# Altium schematic sheet LSE_Piezo_Driver.SchDoc
size A4
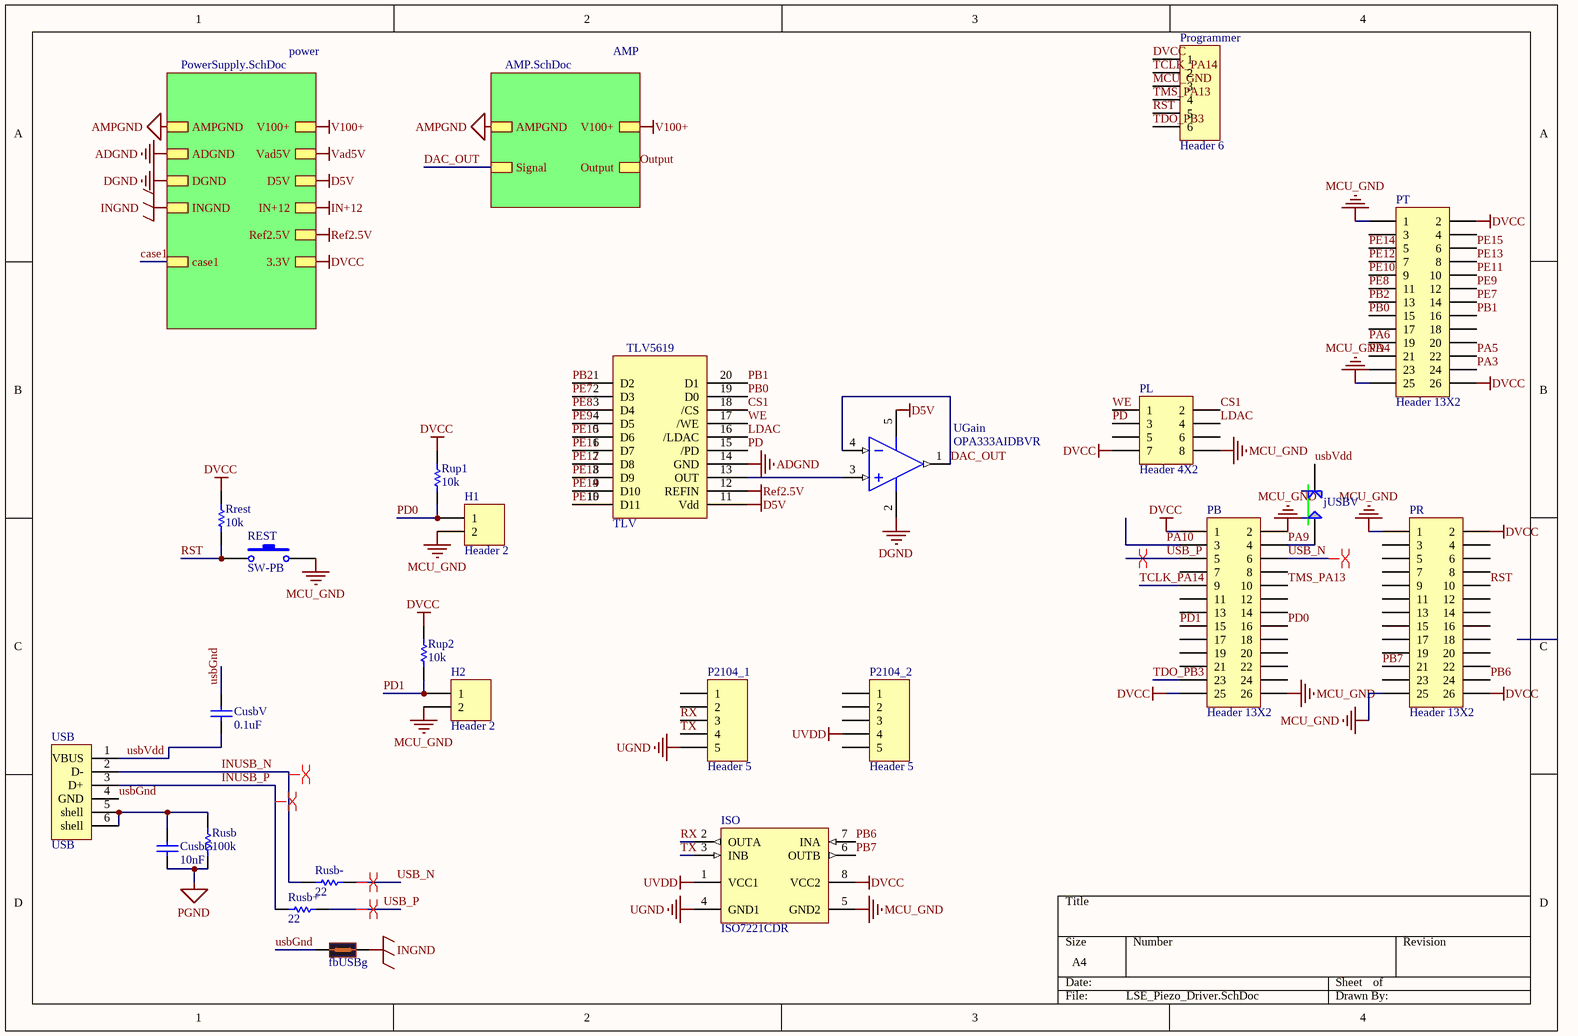
[diagram p0: LSE_Piezo_Driver.SchDoc]

## Parts
CusbG  value 10nF  [C_0603]  (hidden comment: ?)
CusbV  value 0.1uF  [C_0603]  (hidden comment: ?)
fbUSBg  MH2029-300YCT-ND  [FB_0805]  (value not drawn)
H1  Header 2  [HDR1X2]
H2  Header 2  [HDR1X2]
ISO  ISO7221CDR  [D0008A_N]
jUSBV  Jumper  [HDR1X2]  (value not drawn)
P2104_1  Header 5  [HDR1X5]
P2104_2  Header 5  [HDR1X5]
PB  Header 13X2  [HDR2X13]
PL  Header 4X2  [HDR2X4]
PR  Header 13X2  [HDR2X13]
Programmer  Header 6  [HDR1X6]
PT  Header 13X2  [HDR2X13]
REST  SW-PB  [SPST-2]
Rrest  value 10k  [0603]  (hidden comment: ?)
Rup1  value 10k  [0603]  (hidden comment: ?)
Rup2  value 10k  [0603]  (hidden comment: ?)
Rusb  value 100k  [0603]  (hidden comment: ?)
Rusb+  value 22  [0603]  (hidden comment: ?)
Rusb-  value 22  [0603]  (hidden comment: ?)
TLV  TLV5619  [DW020_L]  (value not drawn)
UGain  OPA333AIDBVR  [TI-DBV5_N]
USB  USB  [USB-B]

## Sub-sheets
AMP = AMP.SchDoc: AMPGND, V100+, Output, Signal
power = PowerSupply.SchDoc: ADGND, AMPGND, DGND, INGND, D5V, IN+12, Ref2.5V, V100+, Vad5V, 3.3V, case1

## Nets
ADGND: TLV.14(GND) ; sheet power/ADGND
AMPGND: sheet power/AMPGND, sheet AMP/AMPGND
D5V: TLV.11(Vdd) UGain.5(V+) ; sheet power/D5V
DGND: UGain.2(V-) ; sheet power/DGND
DVCC: ISO.8(VCC2) PB.1 PB.25 PL.7 PR.2 PR.26 Programmer.1 PT.2 PT.26 Rrest.2 Rup1.2 Rup2.2 ; sheet power/3.3V
IN+12: sheet power/IN+12
INGND: fbUSBg.2 ; sheet power/INGND
MCU_GND: H1.2 H2.2 ISO.5(GND2) PB.2 PB.26 PL.8 PR.1 PR.25 Programmer.3 PT.1 PT.25 REST.2
PGND: CusbG.1 Rusb.1
Ref2.5V: TLV.12(REFIN) ; sheet power/Ref2.5V
UGND: ISO.4(GND1) P2104_1.5
UVDD: ISO.1(VCC1) P2104_2.4
V100+: sheet power/V100+, sheet AMP/V100+
Vad5V: sheet power/Vad5V
case1: sheet power/case1
CS1: PL.2 TLV.18(/CS)
DAC_OUT: UGain.1(OUT) UGain.4(IN-) ; sheet AMP/Signal
INUSB_N: Rusb-.1 USB.2(D-)
INUSB_P: Rusb+.1 USB.3(D+)
LDAC: PL.4 TLV.16(/LDAC)
Output: sheet AMP/Output
PA3: PT.24
PA4: PT.21
PA5: PT.22
PA6: PT.19
PA9: jUSBV.1 PB.4
PA10: PB.3
PB0: PT.15 TLV.19(D0)
PB1: PT.16 TLV.20(D1)
PB2: PT.13 TLV.1(D2)
PB6: ISO.7(INA) PR.24
PB7: ISO.6(OUTB) PR.21
PD: PL.3 TLV.15(/PD)
PD0: H1.1 PB.16 Rup1.1
PD1: H2.1 PB.15 Rup2.1
PE7: PT.14 TLV.2(D3)
PE8: PT.11 TLV.3(D4)
PE9: PT.12 TLV.4(D5)
PE10: PT.9 TLV.5(D6)
PE11: PT.10 TLV.6(D7)
PE12: PT.7 TLV.7(D8)
PE13: PT.8 TLV.8(D9)
PE14: PT.5 TLV.9(D10)
PE15: PT.6 TLV.10(D11)
RST: PR.10 Programmer.5 REST.1 Rrest.1
RX: ISO.2(OUTA) P2104_1.3
TCLK_PA14: PB.9 Programmer.2
TDO_PB3: PB.23 Programmer.6
TMS_PA13: PB.10 Programmer.4
TX: ISO.3(INB) P2104_1.4
USB_N: PB.6 Rusb-.2
USB_P: PB.5 Rusb+.2
usbGnd: CusbV.2 fbUSBg.1 USB.4(GND)
usbVdd: CusbV.1 jUSBV.2 USB.1(VBUS)
WE: PL.1 TLV.17(/WE)
NetCusbG_2: CusbG.2 Rusb.2 USB.5(shell) USB.6(shell)
NetTLV_13: TLV.13(OUT) UGain.3(IN+)

Not connected (* = marked no-connect by the designer): P2104_1 1 2; P2104_2 1 2 3 5; PB 7 8 11 12 13 14 17 18 19 20 21 22 24; PL 5 6; PR 3 4 5 6 7 8 9 11 12 13 14 15 16 17 18 19 20 22 23; PT 3 4 17 18 20 23

## Layout directives
differential pair: INUSB_N, INUSB_P, USB_N, USB_P

## Library data of the parts
CusbG CusbV = Csemi: Capacitor (Semiconductor SIM Model); PartNO: ?
fbUSBg = FerriteBead: Ferrite bead; Value: 30; PartNO: MH2029-300YCT-ND
H1 H2 = Header 2: Header, 2-Pin; LatestRevisionDate: 17-Jul-2002; LatestRevisionNote: Re-released for DXP Platform.; Publisher: Altium Limited
ISO = ISO7221CDR: 25 Mbps Dual Channels, 1 / 1, Digital Isolator, 3.3 V / 5 V, -40 to +125 degC, 8-pin SOIC (D), Green (RoHS & no Sb/Br); Manufacturer: Texas Instruments; Datarate(Mbps): 25; Input Noise Filter: Yes; Insulation Rating(VRMS): 2500; Prop Delay(Max)(ns): 42; Rating: Catalog; Supply Voltage(s)(V): 3.3, 5; TTL/CMOS Input Threshold: TTL; DatasheetVersion: SLLS755L; PackageVersion: 4040047-3/M, 06/2011; PackageReference: D0008A; PackageDescription: 8-Pin Plastic Small Outline, Body 4.9 x 3.9 mm, Pitch 1.27 mm; Supplier 1: Digi-Key; Supplier Part Number 1: 296-21956-2-ND; Supplier 2: Digi-Key; Supplier Part Number 2: 296-21956-1-ND; Supplier 3: Digi-Key; Supplier Part Number 3: 296-21956-6-ND; Supplier 4: Newark; Supplier Part Number 4: 48M0675; Supplier 5: Newark; Supplier Part Number 5: 28X3038; Supplier 6: Mouser; Supplier Part Number 6: 595-ISO7221CDR; Eco-Plan: Green (RoHS & no Sb/Br); SubFamily: Isolator; Thermal Shutdown: No; MountType: SMT; Code_JEDEC: MS-012; PartNumber: ISO7221CDR; ComponentLink1Description: Manufacturer URL; ComponentLink1URL: http://www.ti.com/; ComponentLink2Description: Datasheet; ComponentLink2URL: http://www.ti.com/general/docs/lit/getliterature.tsp?genericPartNumber=ISO7221C&fileType=pdf; ComponentLink3Description: Package Specification; ComponentLink3URL: http://www.ti.com/litv/pdf/msoi002j; ComponentLink4Description: SamplesURL; ComponentLink4URL: http://www.ti.com/product/iso7221c#samples
jUSBV = Jumper: solderable jumper
P2104_1 P2104_2 = Header 5: Header, 5-Pin; LatestRevisionDate: 17-Jul-2002; LatestRevisionNote: Re-released for DXP Platform.; Publisher: Altium Limited
PB PR PT = Header 13X2: Header, 13-Pin, Dual row; LatestRevisionDate: 17-Jul-2002; LatestRevisionNote: Re-released for DXP Platform.; Publisher: Altium Limited
PL = Header 4X2: Header, 4-Pin, Dual row; LatestRevisionDate: 17-Jul-2002; LatestRevisionNote: Re-released for DXP Platform.; Publisher: Altium Limited
Programmer = Header 6: Header, 6-Pin; LatestRevisionDate: 17-Jul-2002; LatestRevisionNote: Re-released for DXP Platform.; Publisher: Altium Limited
REST = SW-PB: Switch; Published: 24-Mar-1999; LatestRevisionDate: 17-Jul-2002; LatestRevisionNote: Re-released for DXP Platform.; PackageReference: SPST-2; Publisher: Altium Limited; PackageDescription: Switch; 2 Leads
Rrest Rup1 Rup2 Rusb Rusb+ Rusb- = Rsemi: Semiconductor Resistor, SMD; PartNO: ?
UGain = OPA333AIDBVR: 17 uA, MicroPower, Precision, Zero Drift CMOS Operational Amplifier, 1.8 to 5.5 V, -40 to 125 degC, 5-pin SOT23 (DBV5), Green (RoHS & no Sb/Br); Manufacturer: Texas Instruments; CMRR(Min)(dB): 106; IIB(Max)(pA): 200; Iq per channel(Max)(mA): 0.025; Number of Channels: 1; Offset Drift(Typ)(uV/C): 0.02; Slew Rate(Typ)(V/us): 0.16; Sub Family: Low Offset Voltage Amplifier (<=500uV), Low Power Amp (<=500uA), Low Supply Voltage Amplifier (<=2.7V), Precision Amplifier, Zero Drift Precision Amplifier; Total Supply Voltage(Max)(+5V is 5, +/-5V is 10): 5.5; Total Supply Voltage(Min)(+5V is 5, +/-5V is 10): 1.8; Vio (25C)(Max)(mV): 0.01; DatasheetVersion: SBOS351C; PackageVersion: 4073253-4/K, 03/2006; PackageReference: DBV5; PackageDescription: 5-Pin Plastic Small Outline, Body 1.6 x 2.9 mm, Pitch 0.95 mm; Supplier 1: Digi-Key; Supplier Part Number 1: 296-26269-2-ND; Supplier 2: Digi-Key; Supplier Part Number 2: 296-26269-1-ND; Supplier 3: Digi-Key; Supplier Part Number 3: 296-26269-6-ND; Supplier 4: Newark; Supplier Part Number 4: 80K2658; Supplier 5: Mouser; Supplier Part Number 5: 595-OPA333AIDBVR; Eco-Plan: Green (RoHS & no Sb/Br); Mounting Technology: Surface Mount; Code_JEDEC: MO-178; PartNumber: OPA333AIDBVR; ComponentLink1Description: Manufacturer URL; ComponentLink1URL: http://www.ti.com/; ComponentLink2Description: Datasheet; ComponentLink2URL: http://www.ti.com/general/docs/lit/getliterature.tsp?genericPartNumber=OPA333&fileType=pdf; ComponentLink3Description: Package Specification; ComponentLink3URL: http://www.ti.com/litv/pdf/mpds018i